# Altium schematic sheet APP_1_FlashSPI.SchDoc
size Tabloid; SheetNumber: 10; SheetTotal: 10; Sheet_Name: Flash SPI; Size: 11x17
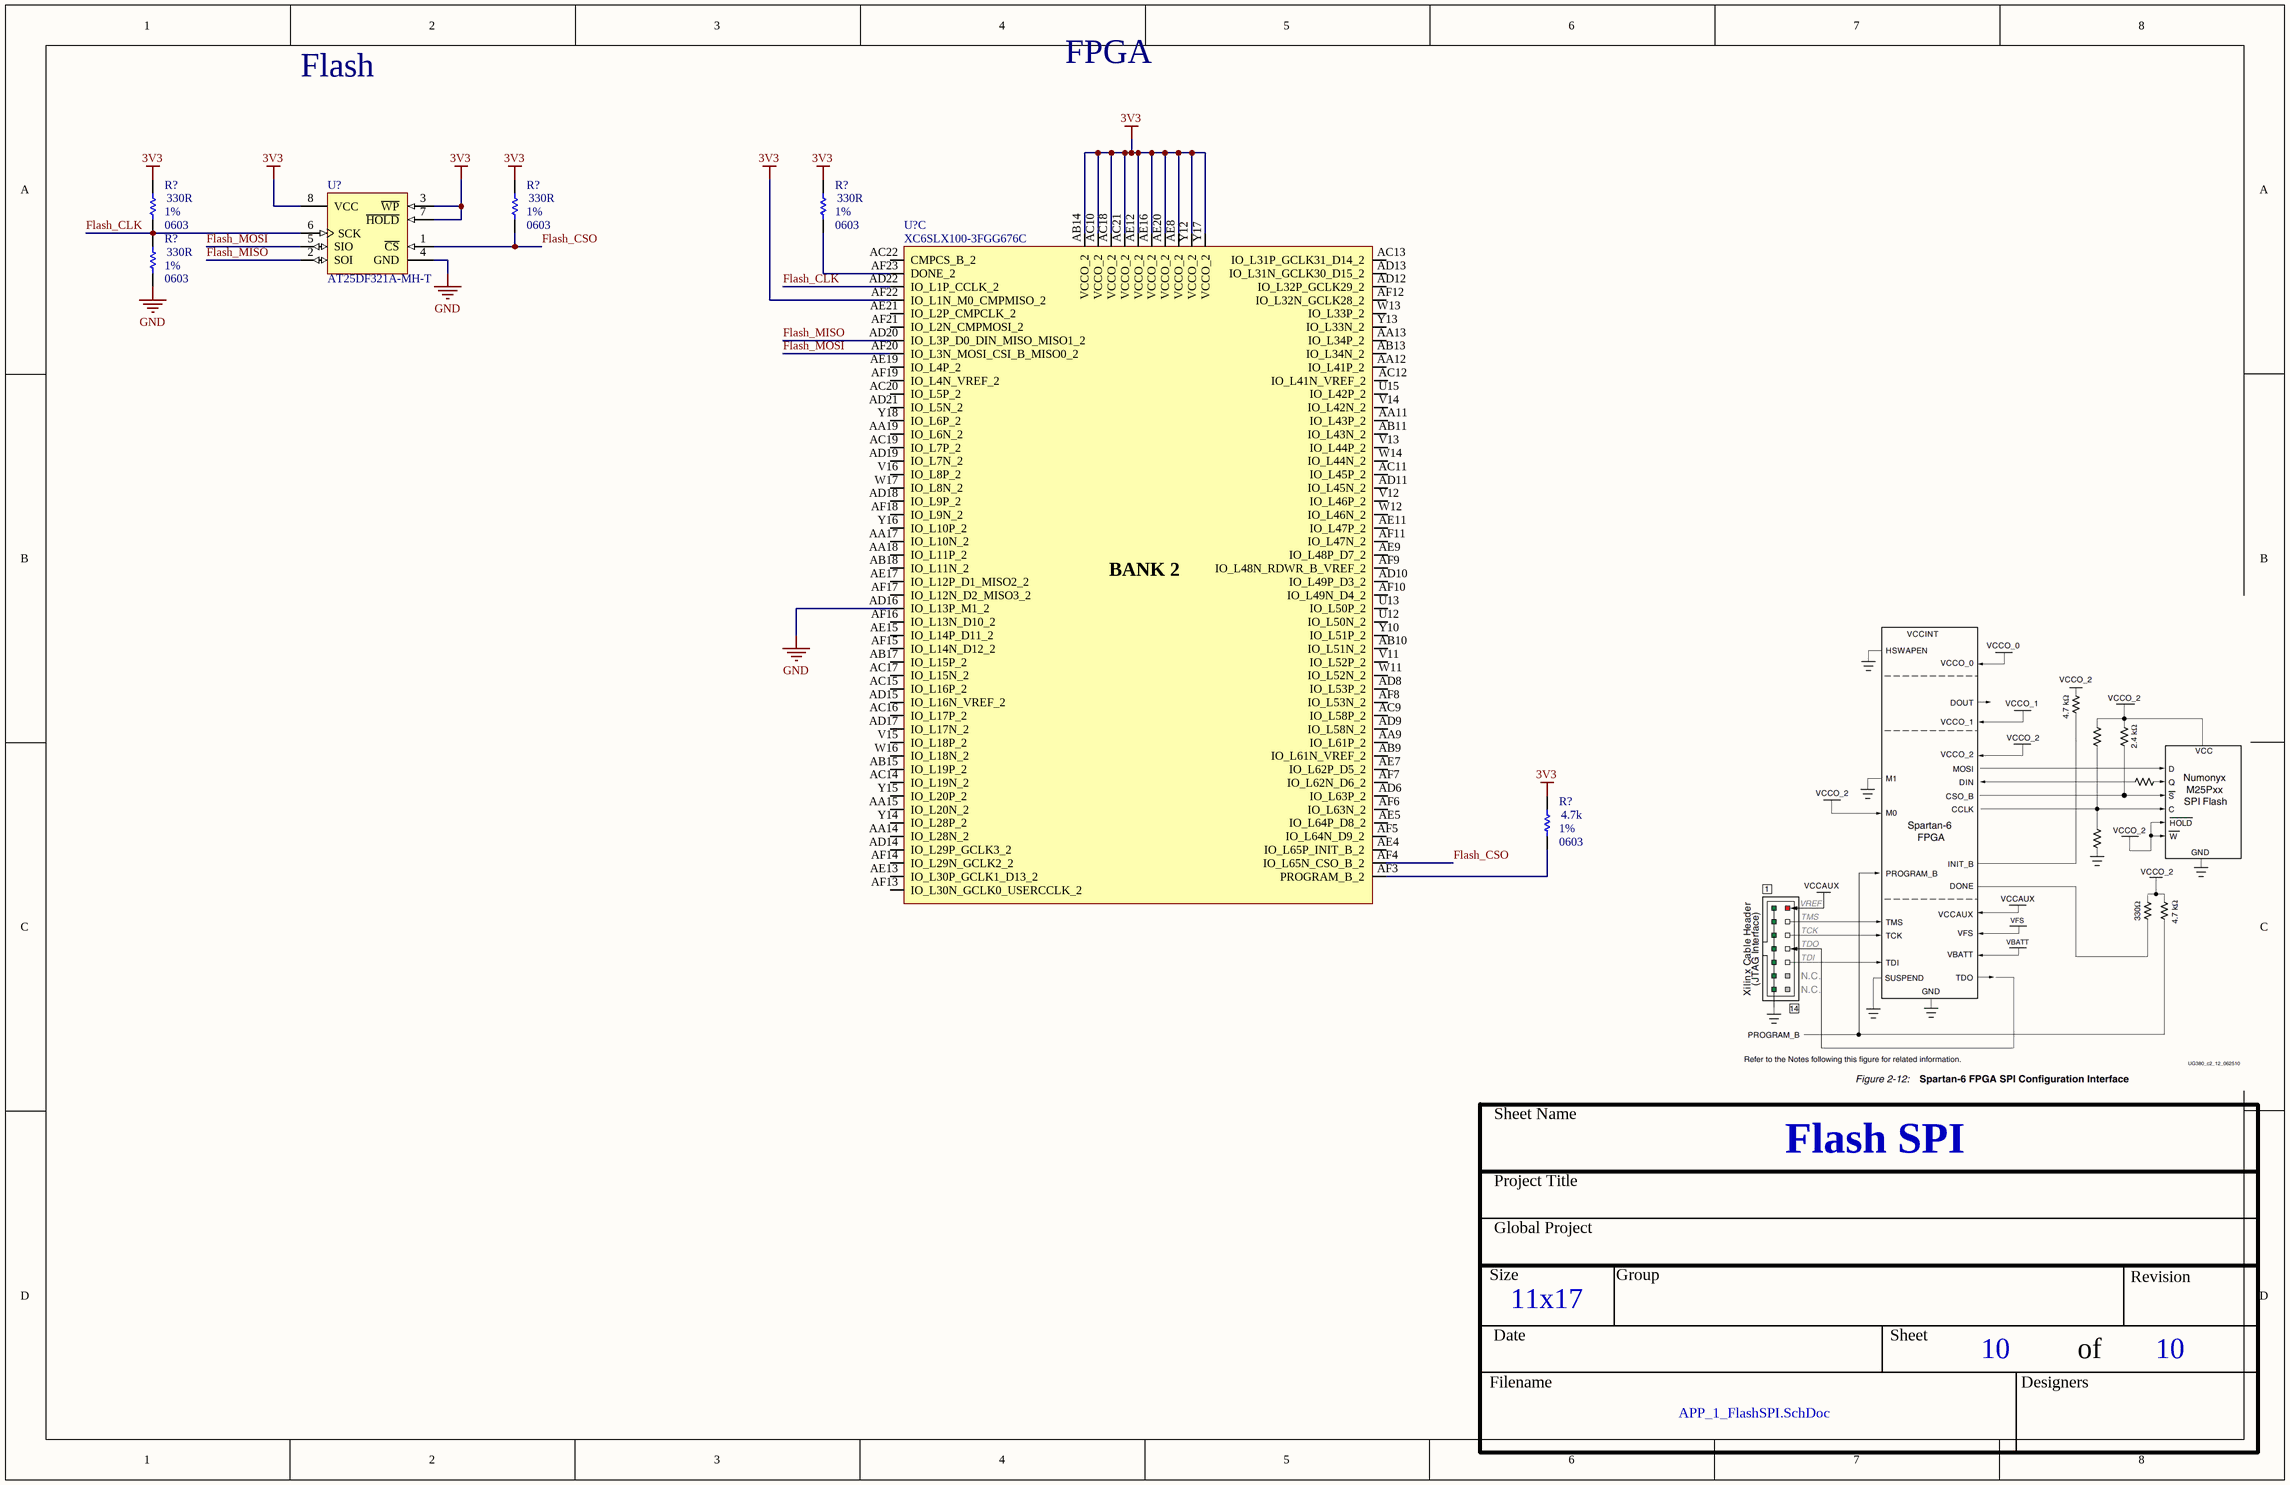
[diagram p0: APP_1_FlashSPI.SchDoc]

## Parts
(Parts that share a designator on the sheet are numbered #1, #2 ... from top to bottom, then left to right.)
R?#1  value 330R  Package: 0603  Precision: 1%  [RES_0603]  (hidden comment: RES - 0603)
R?#2  value 330R  Package: 0603  Precision: 1%  [RES_0603]  (hidden comment: RES - 0603)
R?#3  value 330R  Package: 0603  Precision: 1%  [RES_0603]  (hidden comment: RES - 0603)
R?#4  value 330R  Package: 0603  Precision: 1%  [RES_0603]  (hidden comment: RES - 0603)
R?#5  value 4.7k  Package: 0603  Precision: 1%  [RES_0603]  (hidden comment: RES - 0603)
U?#1  AT25DF321A-MH-T  [ADST-MA1-8_L]
U?#2  XC6SLX100-3FGG676C  [FPGA_XILINX_FGG676]  (part C of 10)

## Nets
3V3: R?#1.2 R?#2.2 R?#3.2 R?#5.2 U?#1.3(~{WP}) U?#1.7(~{HOLD}) U?#1.8(VCC) U?#2.AB14(VCCO_2) U?#2.AC10(VCCO_2) U?#2.AC18(VCCO_2) U?#2.AC21(VCCO_2) U?#2.AE8(VCCO_2) U?#2.AE12(VCCO_2) U?#2.AE16(VCCO_2) U?#2.AE20(VCCO_2) U?#2.AF22(IO_L1N_M0_CMPMISO_2) U?#2.Y12(VCCO_2) U?#2.Y17(VCCO_2)
GND: R?#4.1 U?#1.4(GND) U?#2.AD16(IO_L13P_M1_2)
Flash_CLK: R?#1.1 R?#4.2 U?#1.6(SCK) U?#2.AD22(IO_L1P_CCLK_2)
Flash_CSO: R?#2.1 U?#1.1(~{CS}) U?#2.AF4(IO_L65N_CSO_B_2)
Flash_MISO: U?#1.2(SOI) U?#2.AD20(IO_L3P_D0_DIN_MISO_MISO1_2)
Flash_MOSI: U?#1.5(SIO) U?#2.AF20(IO_L3N_MOSI_CSI_B_MISO0_2)
NetR?#3_1: R?#3.1 U?#2.AF23(DONE_2)
NetR?#5_1: R?#5.1 U?#2.AF3(PROGRAM_B_2)

Not connected (* = marked no-connect by the designer): U?#2 AA9(IO_L61P_2) AA11(IO_L43P_2) AA12(IO_L41P_2) AA13(IO_L34P_2) AA14(IO_L28N_2) AA15(IO_L20N_2) AA17(IO_L10N_2) AA18(IO_L11P_2) AA19(IO_L6N_2) AB9(IO_L61N_VREF_2) AB10(IO_L51N_2) AB11(IO_L43N_2) AB13(IO_L34N_2) AB15(IO_L19P_2) AB17(IO_L15P_2) AB18(IO_L11N_2) AC9(IO_L58P_2) AC11(IO_L45P_2) AC12(IO_L41N_VREF_2) AC13(IO_L31P_GCLK31_D14_2) AC14(IO_L19N_2) AC15(IO_L16P_2) AC16(IO_L17P_2) AC17(IO_L15N_2) AC19(IO_L7P_2) AC20(IO_L5P_2) AC22(CMPCS_B_2) AD6(IO_L63P_2) AD8(IO_L53P_2) AD9(IO_L58N_2) AD10(IO_L49P_D3_2) AD11(IO_L45N_2) AD12(IO_L32P_GCLK29_2) AD13(IO_L31N_GCLK30_D15_2) AD14(IO_L29P_GCLK3_2) AD15(IO_L16N_VREF_2) AD17(IO_L17N_2) AD18(IO_L9P_2) AD19(IO_L7N_2) AD21(IO_L5N_2) AE4(IO_L65P_INIT_B_2) AE5(IO_L64P_D8_2) AE7(IO_L62P_D5_2) AE9(IO_L48P_D7_2) AE11(IO_L47P_2) AE13(IO_L30P_GCLK1_D13_2) AE15(IO_L14P_D11_2) AE17(IO_L12P_D1_MISO2_2) AE19(IO_L4P_2) AE21(IO_L2P_CMPCLK_2) AF5(IO_L64N_D9_2) AF6(IO_L63N_2) AF7(IO_L62N_D6_2) AF8(IO_L53N_2) AF9(IO_L48N_RDWR_B_VREF_2) AF10(IO_L49N_D4_2) AF11(IO_L47N_2) AF12(IO_L32N_GCLK28_2) AF13(IO_L30N_GCLK0_USERCCLK_2) AF14(IO_L29N_GCLK2_2) AF15(IO_L14N_D12_2) AF16(IO_L13N_D10_2) AF17(IO_L12N_D2_MISO3_2) AF18(IO_L9N_2) AF19(IO_L4N_VREF_2) AF21(IO_L2N_CMPMOSI_2) U12(IO_L50N_2) U13(IO_L50P_2) U15(IO_L42P_2) V11(IO_L52P_2) V12(IO_L46P_2) V13(IO_L44P_2) V14(IO_L42N_2) V15(IO_L18P_2) V16(IO_L8P_2) W11(IO_L52N_2) W12(IO_L46N_2) W13(IO_L33P_2) W14(IO_L44N_2) W16(IO_L18N_2) W17(IO_L8N_2) Y10(IO_L51P_2) Y13(IO_L33N_2) Y14(IO_L28P_2) Y15(IO_L20P_2) Y16(IO_L10P_2) Y18(IO_L6P_2)

## Notes on the sheet
- Flash
- FPGA
- Sheet Name
- Project Title
- Global Project
- Size
- Group
- Revision
- Date
- Sheet
- of
- Filename
- Designers
- (in symbol FPGA_XC6SLX100-3FGG676C, part C) BANK 2

## Library data of the parts
U?#1 = FLA_AT25DF321A-MH-T: SPI Serial Flash Memory, 32 Megabit, 100 MHz, 2.7 to 3.6 V, -40 to 85 degC, 8-Pin UDFN (MA1-8), RoHS, Tape and Reel; Manufacturer: Adesto; Max. Freq: 100 MHz; Packing: Tape and Reel; PackageVersion: Rev. D; PartNumber: AT25DF321A-MH-T; RoHS: TRUE; PackageReference: MA1-8; ComponentLink2Description: Datasheet; Device Density: 32 Megabit; PackageDescription: 8-Pin Thermally Enhanced Plastic Ultra Thin Dual Flat No Lead Package, Body 5 x 6 mm, Pitch 1.27 mm; ComponentLink2URL: http://www.adestotech.com/sites/default/files/datasheets/doc3686.pdf; DatasheetVersion: Rev. 3686E; Mounting Technology: Surface Mount; ComponentLink1URL: http://www.adestotech.com/; ComponentLink1Description: Manufacturer URL; Interface: Serial; ComponentLink3Description: Package Specification; Operating Temperature: -40 to 85 degC; Operating Voltage: 2.7 to 3.6 V; ComponentLink3URL: http://www.adestotech.com/sites/default/files/datasheets/doc3668.pdf
U?#2 = FPGA_XC6SLX100-3FGG676C: FPGA - XILINX SPARTAN 6 480 I/O - BGA-676; Voltage: 1.14 V ~ 1.26 V; Current: *; Power: *; Mfg: Xilinx; Mfg Part Number: XC6SLX100-3FGG676C; HelpURL: https://www.xilinx.com/support/documentation/data_sheets/ds162.pdf; CreatedBy: Jonathan Bouchard; Temperature: 0°C ~ 85°C (TJ); Value: *; Precision: *; Package: BGA-676; Supplier 1: Digikey; Supplier Part Number 1: 122-1760-ND
R?#1-R?#5 = RES - 0603: Current: *; CreatedBy: Jonathan Bouchard